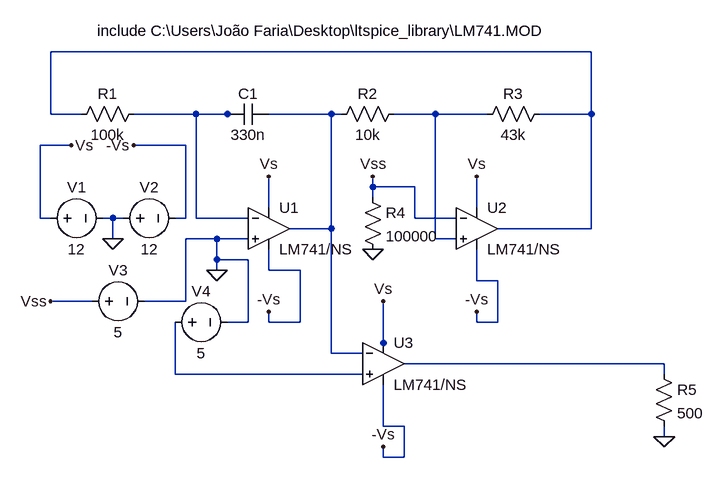
[diagram p0: schematic Actuation_circuit_schematic_V1.asc]
Actuation_circuit_schematic_V1.asc, the LTspice schematic file:
Version 4
SHEET 1 928 680
WIRE 560 -224 -272 -224
WIRE -272 -128 -272 -224
WIRE -224 -128 -272 -128
WIRE -48 -128 -144 -128
WIRE 0 -128 -48 -128
WIRE 16 -128 0 -128
WIRE 160 -128 64 -128
WIRE 176 -128 160 -128
WIRE 320 -128 256 -128
WIRE 400 -128 320 -128
WIRE 560 -128 560 -224
WIRE 560 -128 480 -128
WIRE -240 -80 -288 -80
WIRE -64 -80 -144 -80
WIRE 224 -16 224 -32
WIRE 288 -16 224 -16
WIRE 224 0 224 -16
WIRE 64 16 64 -32
WIRE 384 16 384 -32
WIRE -288 32 -288 -80
WIRE -272 32 -288 32
WIRE -176 32 -192 32
WIRE -160 32 -176 32
WIRE -64 32 -64 -80
WIRE -64 32 -80 32
WIRE -48 32 -48 -128
WIRE 32 32 -48 32
WIRE 288 32 288 -16
WIRE 352 32 288 32
WIRE 160 48 160 -128
WIRE 160 48 96 48
WIRE 560 48 560 -128
WIRE 560 48 416 48
WIRE -176 64 -176 32
WIRE -16 64 -64 64
WIRE 32 64 -16 64
WIRE 320 64 320 -128
WIRE 352 64 320 64
WIRE -16 96 -16 64
WIRE 32 96 -16 96
WIRE -16 112 -16 96
WIRE 64 112 64 80
WIRE 112 112 64 112
WIRE 384 128 384 80
WIRE 416 128 384 128
WIRE -208 160 -272 160
WIRE -64 160 -64 64
WIRE -64 160 -128 160
WIRE 32 192 32 96
WIRE 32 192 0 192
WIRE 64 192 64 176
WIRE 112 192 112 112
WIRE 112 192 64 192
WIRE 384 192 384 176
WIRE 416 192 416 128
WIRE 416 192 384 192
WIRE 240 224 240 160
WIRE 160 240 160 48
WIRE 208 240 160 240
WIRE 240 240 240 224
WIRE 672 256 272 256
WIRE -80 272 -80 192
WIRE 208 272 -80 272
WIRE 672 272 672 256
WIRE 240 352 240 288
WIRE 272 352 240 352
WIRE 672 368 672 352
WIRE 240 400 240 384
WIRE 272 400 272 352
WIRE 272 400 240 400
FLAG -16 112 0
FLAG 224 80 0
FLAG 224 -32 Vss
FLAG 64 -32 Vs
FLAG 384 -32 Vs
FLAG 64 176 -Vs
FLAG 384 176 -Vs
FLAG 240 384 -Vs
FLAG 240 160 Vs
FLAG -240 -80 Vs
FLAG -144 -80 -Vs
FLAG -176 64 0
FLAG -272 160 Vss
FLAG 672 368 0
SYMBOL Opamps\\opamp2 64 -16 R0
SYMATTR InstName U1
SYMATTR Value LM741/NS
SYMBOL res -128 -144 R90
WINDOW 0 0 56 VBottom 2
WINDOW 3 32 56 VTop 2
SYMATTR InstName R1
SYMATTR Value 100k
SYMBOL res 272 -144 R90
WINDOW 0 0 56 VBottom 2
WINDOW 3 32 56 VTop 2
SYMATTR InstName R2
SYMATTR Value 10k
SYMBOL res 496 -144 R90
WINDOW 0 0 56 VBottom 2
WINDOW 3 32 56 VTop 2
SYMATTR InstName R3
SYMATTR Value 43k
SYMBOL Opamps\\opamp2 384 -16 R0
SYMATTR InstName U2
SYMATTR Value LM741/NS
SYMBOL Opamps\\opamp2 240 192 R0
SYMATTR InstName U3
SYMATTR Value LM741/NS
SYMBOL cap 64 -144 R90
WINDOW 0 0 32 VBottom 2
WINDOW 3 32 32 VTop 2
SYMATTR InstName C1
SYMATTR Value 330n
SYMBOL res 208 -16 R0
SYMATTR InstName R4
SYMATTR Value 100000
SYMBOL voltage -288 32 R270
WINDOW 0 32 56 VTop 2
WINDOW 3 -32 56 VBottom 2
WINDOW 123 0 0 Left 0
WINDOW 39 0 0 Left 0
SYMATTR InstName V1
SYMATTR Value 12
SYMBOL voltage -176 32 R270
WINDOW 0 32 56 VTop 2
WINDOW 3 -32 56 VBottom 2
WINDOW 123 0 0 Left 0
WINDOW 39 0 0 Left 0
SYMATTR InstName V2
SYMATTR Value 12
SYMBOL voltage -224 160 R270
WINDOW 0 32 56 VTop 2
WINDOW 3 -32 56 VBottom 2
WINDOW 123 0 0 Left 0
WINDOW 39 0 0 Left 0
SYMATTR InstName V3
SYMATTR Value 5
SYMBOL res 656 256 R0
SYMATTR InstName R5
SYMATTR Value 500
SYMBOL voltage -96 192 R270
WINDOW 0 32 56 VTop 2
WINDOW 3 -32 56 VBottom 2
WINDOW 123 0 0 Left 0
WINDOW 39 0 0 Left 0
SYMATTR InstName V4
SYMATTR Value 5
TEXT -200 -256 Left 2 !include C:\\Users\\João Faria\\Desktop\\ltspice_library\\LM741.MOD

The netlist it stands for:
* Actuation_circuit_schematic_V1.asc
XU1 0 N002 Vs -Vs N003 LM741/NS  ; pins In+ In- V+ V- OUT
R1 N002 N001 100k
R2 N004 N003 10k
R3 N001 N004 43k
XU2 N004 Vss Vs -Vs N001 LM741/NS  ; pins In+ In- V+ V- OUT
XU3 N006 N003 Vs -Vs N005 LM741/NS  ; pins In+ In- V+ V- OUT
C1 N003 N002 330n
R4 Vss 0 100000
V1 Vs 0 12
V2 0 -Vs 12
V3 Vss 0 5
R5 N005 0 500
V4 N006 0 5
include C:\Users\João Faria\Desktop\ltspice_library\LM741.MOD
.backanno
.end